# EAGLE design 32_ch_sample_and_hold_v3 (EAGLE 7.2.0)
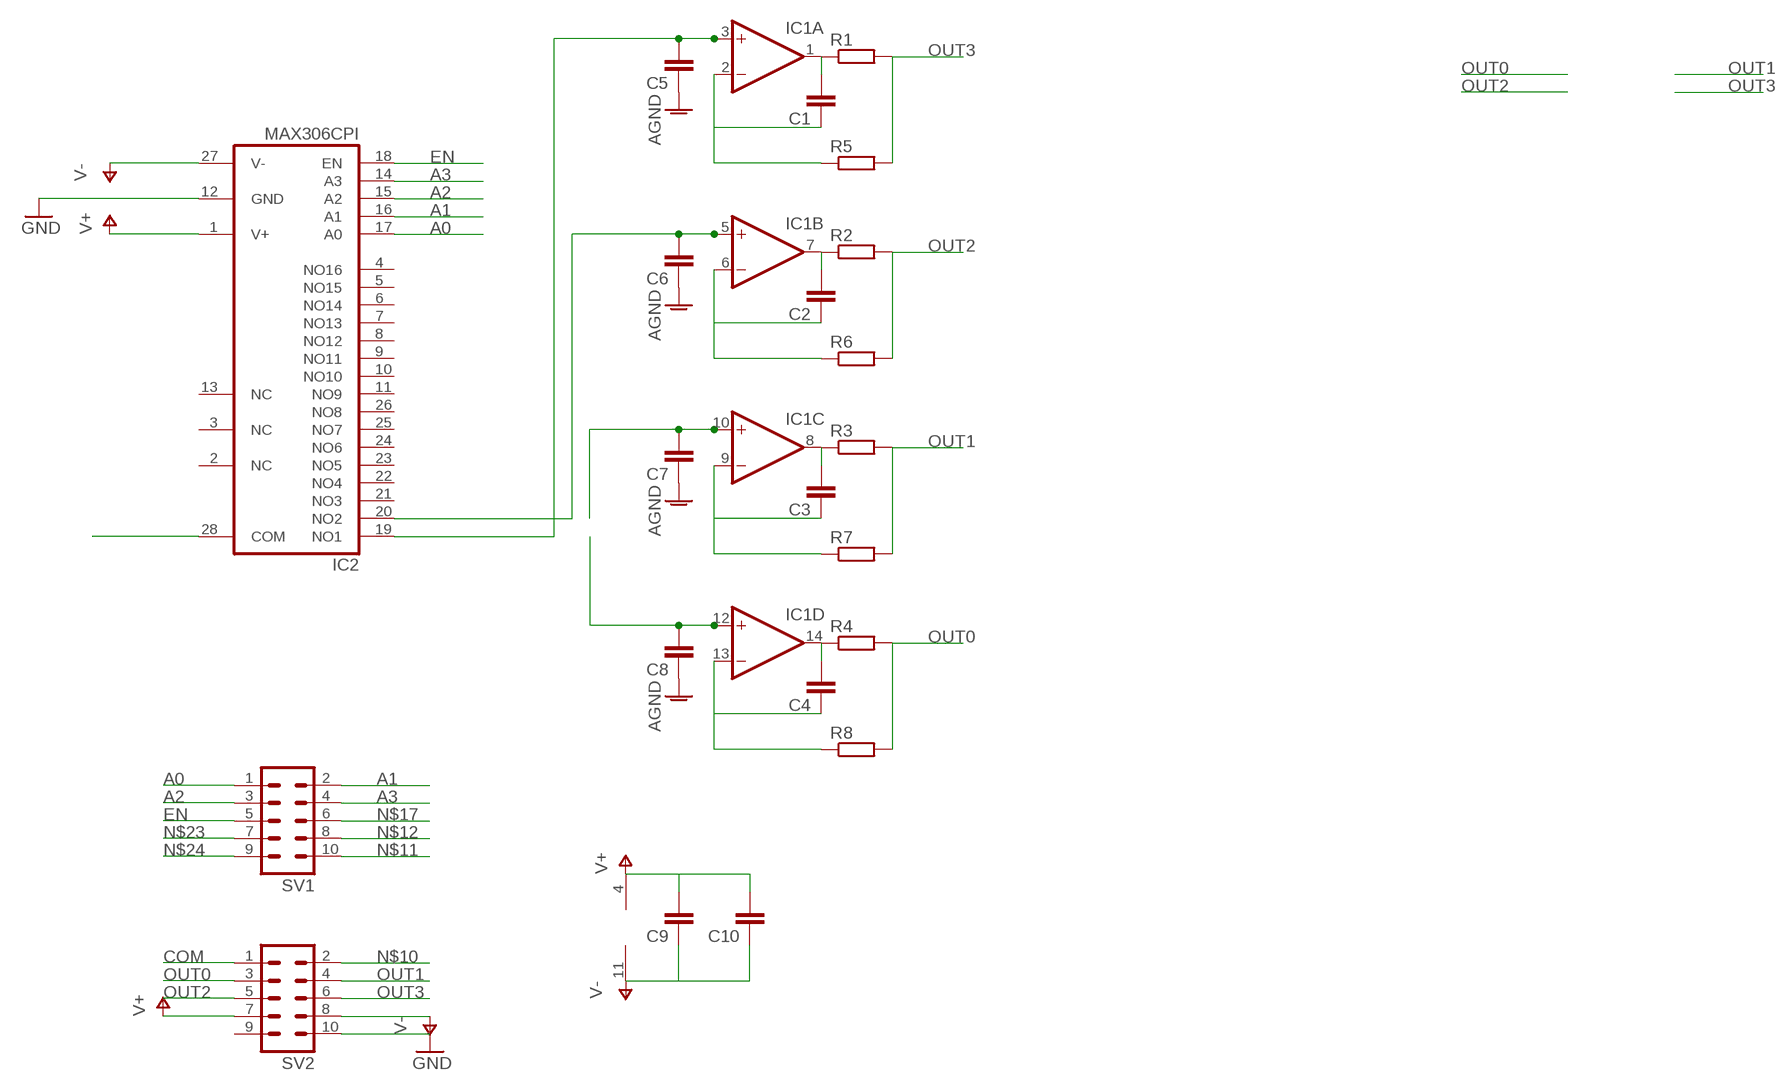
[diagram p0: schematic, sheet 1]

## Parts
C1  C-EU025-025X050  [C025-025X050]
C2  C-EU025-025X050  [C025-025X050]
C3  C-EU025-025X050  [C025-025X050]
C4  C-EU025-025X050  [C025-025X050]
C5  C-EU025-025X050  [C025-025X050]
C6  C-EU025-025X050  [C025-025X050]
C7  C-EU025-025X050  [C025-025X050]
C8  C-EU025-025X050  [C025-025X050]
C9  C-EU025-025X050  [C025-025X050]
C10  C-EU025-025X050  [C025-025X050]
IC1  TL074P  [DIL14]
IC2  MAX306CPI  [DIL28-6]
R1  R-EU_0207/7  [0207/7]
R2  R-EU_0207/7  [0207/7]
R3  R-EU_0207/7  [0207/7]
R4  R-EU_0207/7  [0207/7]
R5  R-EU_0207/7  [0207/7]
R6  R-EU_0207/7  [0207/7]
R7  R-EU_0207/7  [0207/7]
R8  R-EU_0207/7  [0207/7]
SV1  MA05-2  [MA05-2]
SV2  MA05-2  [MA05-2]

## Nets
A0: IC2.17(A0) SV1.1
A1: IC2.16(A1) SV1.2
A2: IC2.15(A2) SV1.3
A3: IC2.14(A3) SV1.4
AGND: C5.1 C6.1 C7.1 C8.1
COM: IC2.28(COM) SV2.1
EN: IC2.18(EN) SV1.5
GND: IC2.12(GND) SV2.10
N$1: C1.2 IC1.1(A:OUT) R1.1
N$2: C2.2 IC1.7(B:OUT) R2.1
N$3: C3.2 IC1.8(C:OUT) R3.1
N$4: C4.2 IC1.14(D:OUT) R4.1
N$5: C1.1 IC1.2(A:-IN) R5.1
N$6: C2.1 IC1.6(B:-IN) R6.1
N$7: C3.1 IC1.9(C:-IN) R7.1
N$8: C4.1 IC1.13(D:-IN) R8.1
N$10: SV2.2
N$11: SV1.10
N$12: SV1.8
N$13: C8.2 IC1.12(D:+IN)
N$14: C7.2 IC1.10(C:+IN)
N$15: C6.2 IC1.5(B:+IN) IC2.20(NO2)
N$16: C5.2 IC1.3(A:+IN) IC2.19(NO1)
N$17: SV1.6
N$23: SV1.7
N$24: SV1.9
OUT0: R4.2 R8.2 SV2.3
OUT1: R3.2 R7.2 SV2.4
OUT2: R2.2 R6.2 SV2.5
OUT3: R1.2 R5.2 SV2.6
V+: C9.2 C10.2 IC1.4(P:V+) IC2.1(V+) SV2.7
V-: C9.1 C10.1 IC1.11(P:V-) IC2.27(V-) SV2.8
Unconnected: IC2.2(NC) IC2.3(NC) IC2.4(NO16) IC2.5(NO15) IC2.6(NO14) IC2.7(NO13) IC2.8(NO12) IC2.9(NO11) IC2.10(NO10) IC2.11(NO9) IC2.13(NC) IC2.21(NO3) IC2.22(NO4) IC2.23(NO5) IC2.24(NO6) IC2.25(NO7) IC2.26(NO8) SV2.9

## Library data of the parts
C1-C10 = resistor:C-EU: CAPACITOR, European symbol
IC1 = linear:TL074: OP AMP
IC2 = maxim:MAX306CPI: MULTIPLEXER; MPN: MAX306CPI; OC_FARNELL: unknown; OC_NEWARK: 90C2554
R1-R8 = resistor:R-EU_: RESISTOR, European symbol
SV1 SV2 = con-lstb:MA05-2: PIN HEADER; OC_FARNELL: unknown; OC_NEWARK: unknown

## Board
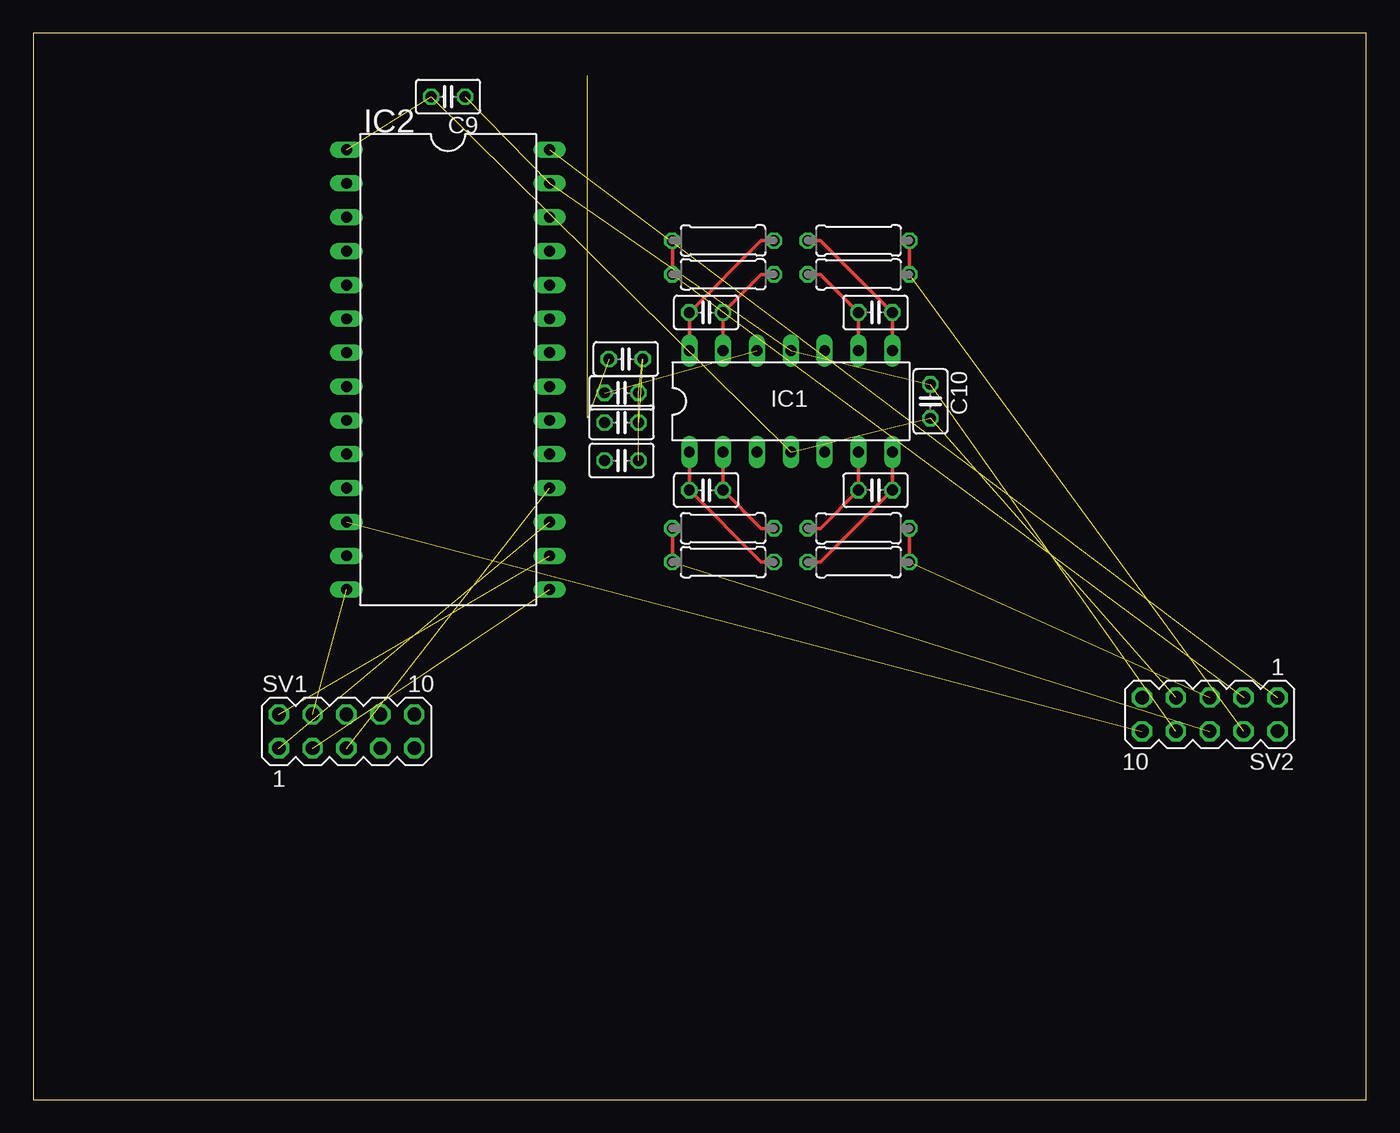
[diagram p1: board, top side]
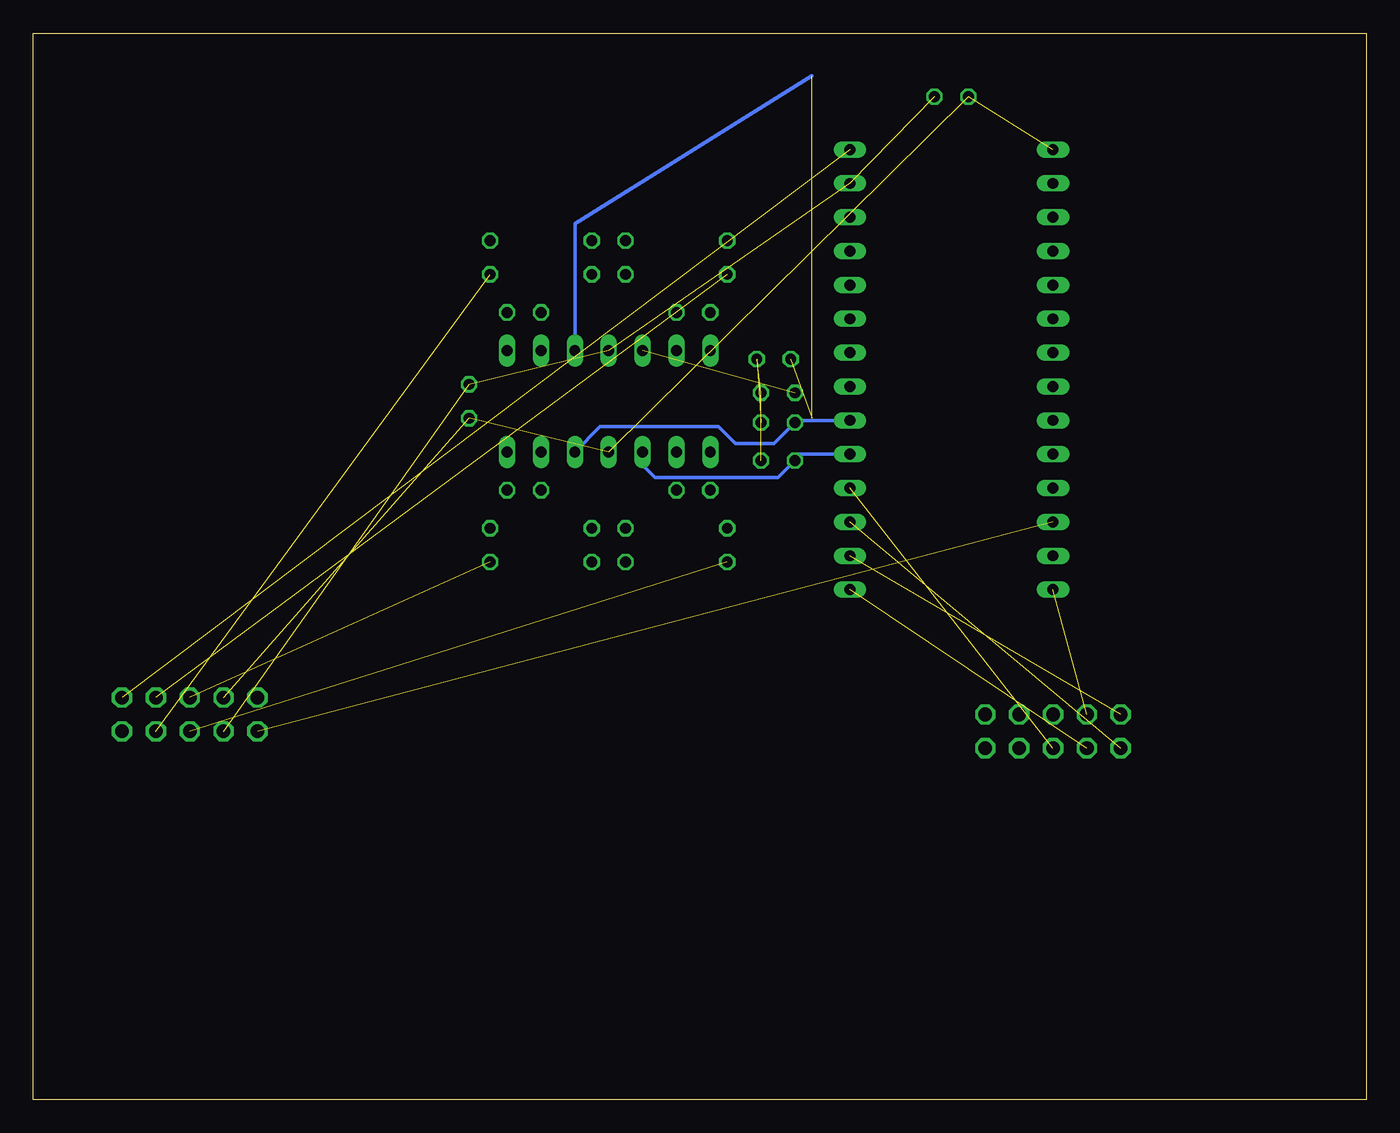
[diagram p2: board, bottom side, seen from below]

Size 100 x 80 mm. Coordinates in mm from the lower left corner, seen from the top.
Outline: 0,0 100,0 100,80 0,80 0,0
Copper layers (1*16): Top 0.0356mm / dielectric 1.5011mm / Bottom 0.0356mm
Design rules "LaenPCBOrder": minimum track width 6mil, minimum drill 13mil, track to track 6mil, track to pad 6mil, pad to pad 6mil, via to via 6mil, smd to smd 6mil, copper to edge 15mil, drill to drill 6mil, minimum pad ring 7mil, minimum via ring 7mil, stop-mask expansion 3mil, vias tented up to drill 0mil, thermal gap 10mil

### Footprints (pad centres in the part's own frame; a part is rotated, then mirrored left to right if it is on the bottom)
C025-025X050 = drill 0.813 octagon: 1 -1.27,0; 2 1.27,0
DIL14 = drill 0.813 long: 1 -7.62,-3.81; 2 -5.08,-3.81; 3 -2.54,-3.81; 4 0,-3.81; 5 2.54,-3.81; 6 5.08,-3.81; 7 7.62,-3.81; 8 7.62,3.81; 9 5.08,3.81; 10 2.54,3.81; 11 0,3.81; 12 -2.54,3.81; 13 -5.08,3.81; 14 -7.62,3.81
DIL28-6 = drill 0.813 long: 1 -16.51,-7.62; 2 -13.97,-7.62; 3 -11.43,-7.62; 4 -8.89,-7.62; 5 -6.35,-7.62; 6 -3.81,-7.62; 7 -1.27,-7.62; 8 1.27,-7.62; 9 3.81,-7.62; 10 6.35,-7.62; 11 8.89,-7.62; 12 11.43,-7.62; 13 13.97,-7.62; 14 16.51,-7.62; 15 16.51,7.62; 16 13.97,7.62; 17 11.43,7.62; 18 8.89,7.62; 19 6.35,7.62; 20 3.81,7.62; 21 1.27,7.62; 22 -1.27,7.62; 23 -3.81,7.62; 24 -6.35,7.62; 25 -8.89,7.62; 26 -11.43,7.62; 27 -13.97,7.62; 28 -16.51,7.62
0207/7 = drill 0.813 octagon: 1 -3.81,0; 2 3.81,0
MA05-2 = drill 1.016 octagon: 1 -5.08,-1.27; 2 -5.08,1.27; 3 -2.54,-1.27; 4 -2.54,1.27; 5 0,-1.27; 6 0,1.27; 7 2.54,-1.27; 8 2.54,1.27; 9 5.08,-1.27; 10 5.08,1.27

### Placement (x,y rotation side)
C1  50.48,45.72 180 top
C2  63.18,45.72 0 top
C3  63.18,59.05 0 top
C4  50.48,59.05 180 top
C5  44.13,47.94 180 top
C6  44.13,50.8 180 top
C7  44.45,55.56 180 top
C8  44.13,53.02 180 top
C9  31.11,75.25 180 top
C10  67.31,52.39 270 top
IC1  56.83,52.39 0 top
IC2  31.11,54.77 270 top
R1  51.75,40.32 180 top
R2  61.91,40.32 0 top
R3  61.91,64.45 0 top
R4  51.75,64.45 180 top
R5  51.75,42.86 180 top
R6  61.91,42.86 0 top
R7  61.91,61.91 0 top
R8  51.75,61.91 180 top
SV1  23.5,27.62 0 top
SV2  88.27,28.89 180 top

### Tracks (layer width: path | path; a pad name or v marks a point on that pad's centre or on a via)
A0  (1 unrouted)
A1  (1 unrouted)
A2  (1 unrouted)
A3  (1 unrouted)
AGND  (3 unrouted)
COM  (1 unrouted)
EN  (1 unrouted)
GND  (1 unrouted)
N$1
  Top 0.254: IC1.1 C1.2 54.61,40.32 R1.1
N$2
  Top 0.254: IC1.7 C2.2 59.05,40.32 R2.1
N$3
  Top 0.254: IC1.8 C3.2 59.05,64.45 R3.1
N$4
  Top 0.254: IC1.14 C4.2 54.61,64.45 R4.1
N$5
  Top 0.254: IC1.2 C1.1 54.61,42.86 R5.1
N$6
  Top 0.254: IC1.6 C2.1 59.05,42.86 R6.1
N$7
  Top 0.254: R7.1 59.05,61.91 C3.1 IC1.9
N$8
  Top 0.254: IC1.13 C4.1 54.61,61.91 R8.1
N$13  (1 unrouted)
N$14  (2 unrouted)
  Bottom 0.254: 41.59,76.83 59.37,65.72 IC1.10
N$15
  Bottom 0.254: IC2.20 42.7,50.96 C6.2 44.45,49.21 47.31,49.21 48.58,50.48 57.47,50.48 IC1.5
N$16
  Bottom 0.254: IC2.19 42.86,48.42 C5.2 44.13,46.67 53.34,46.67 54.29,47.62 IC1.3
OUT0  (1 unrouted)
  Top 0.254: R4.2 R8.2
OUT1  (1 unrouted)
  Top 0.254: R3.2 R7.2
OUT2  (1 unrouted)
  Top 0.254: R6.2 R2.2
OUT3  (1 unrouted)
  Top 0.254: R5.2 R1.2
V+  (4 unrouted)
V-  (4 unrouted)